# EasyEDA Pro project PCB_PressureSensitiveConverterBoard.epro

# Schematic Schematic1
Create Date: 2024-09-02; Page Name: P1; Project Name: FinalConverterBlock; Schematic Name: Schematic1; Update Date: 2024-09-02; Company: THU EE; Drawed: Sxz; Page Size: A4; Version: V1.0
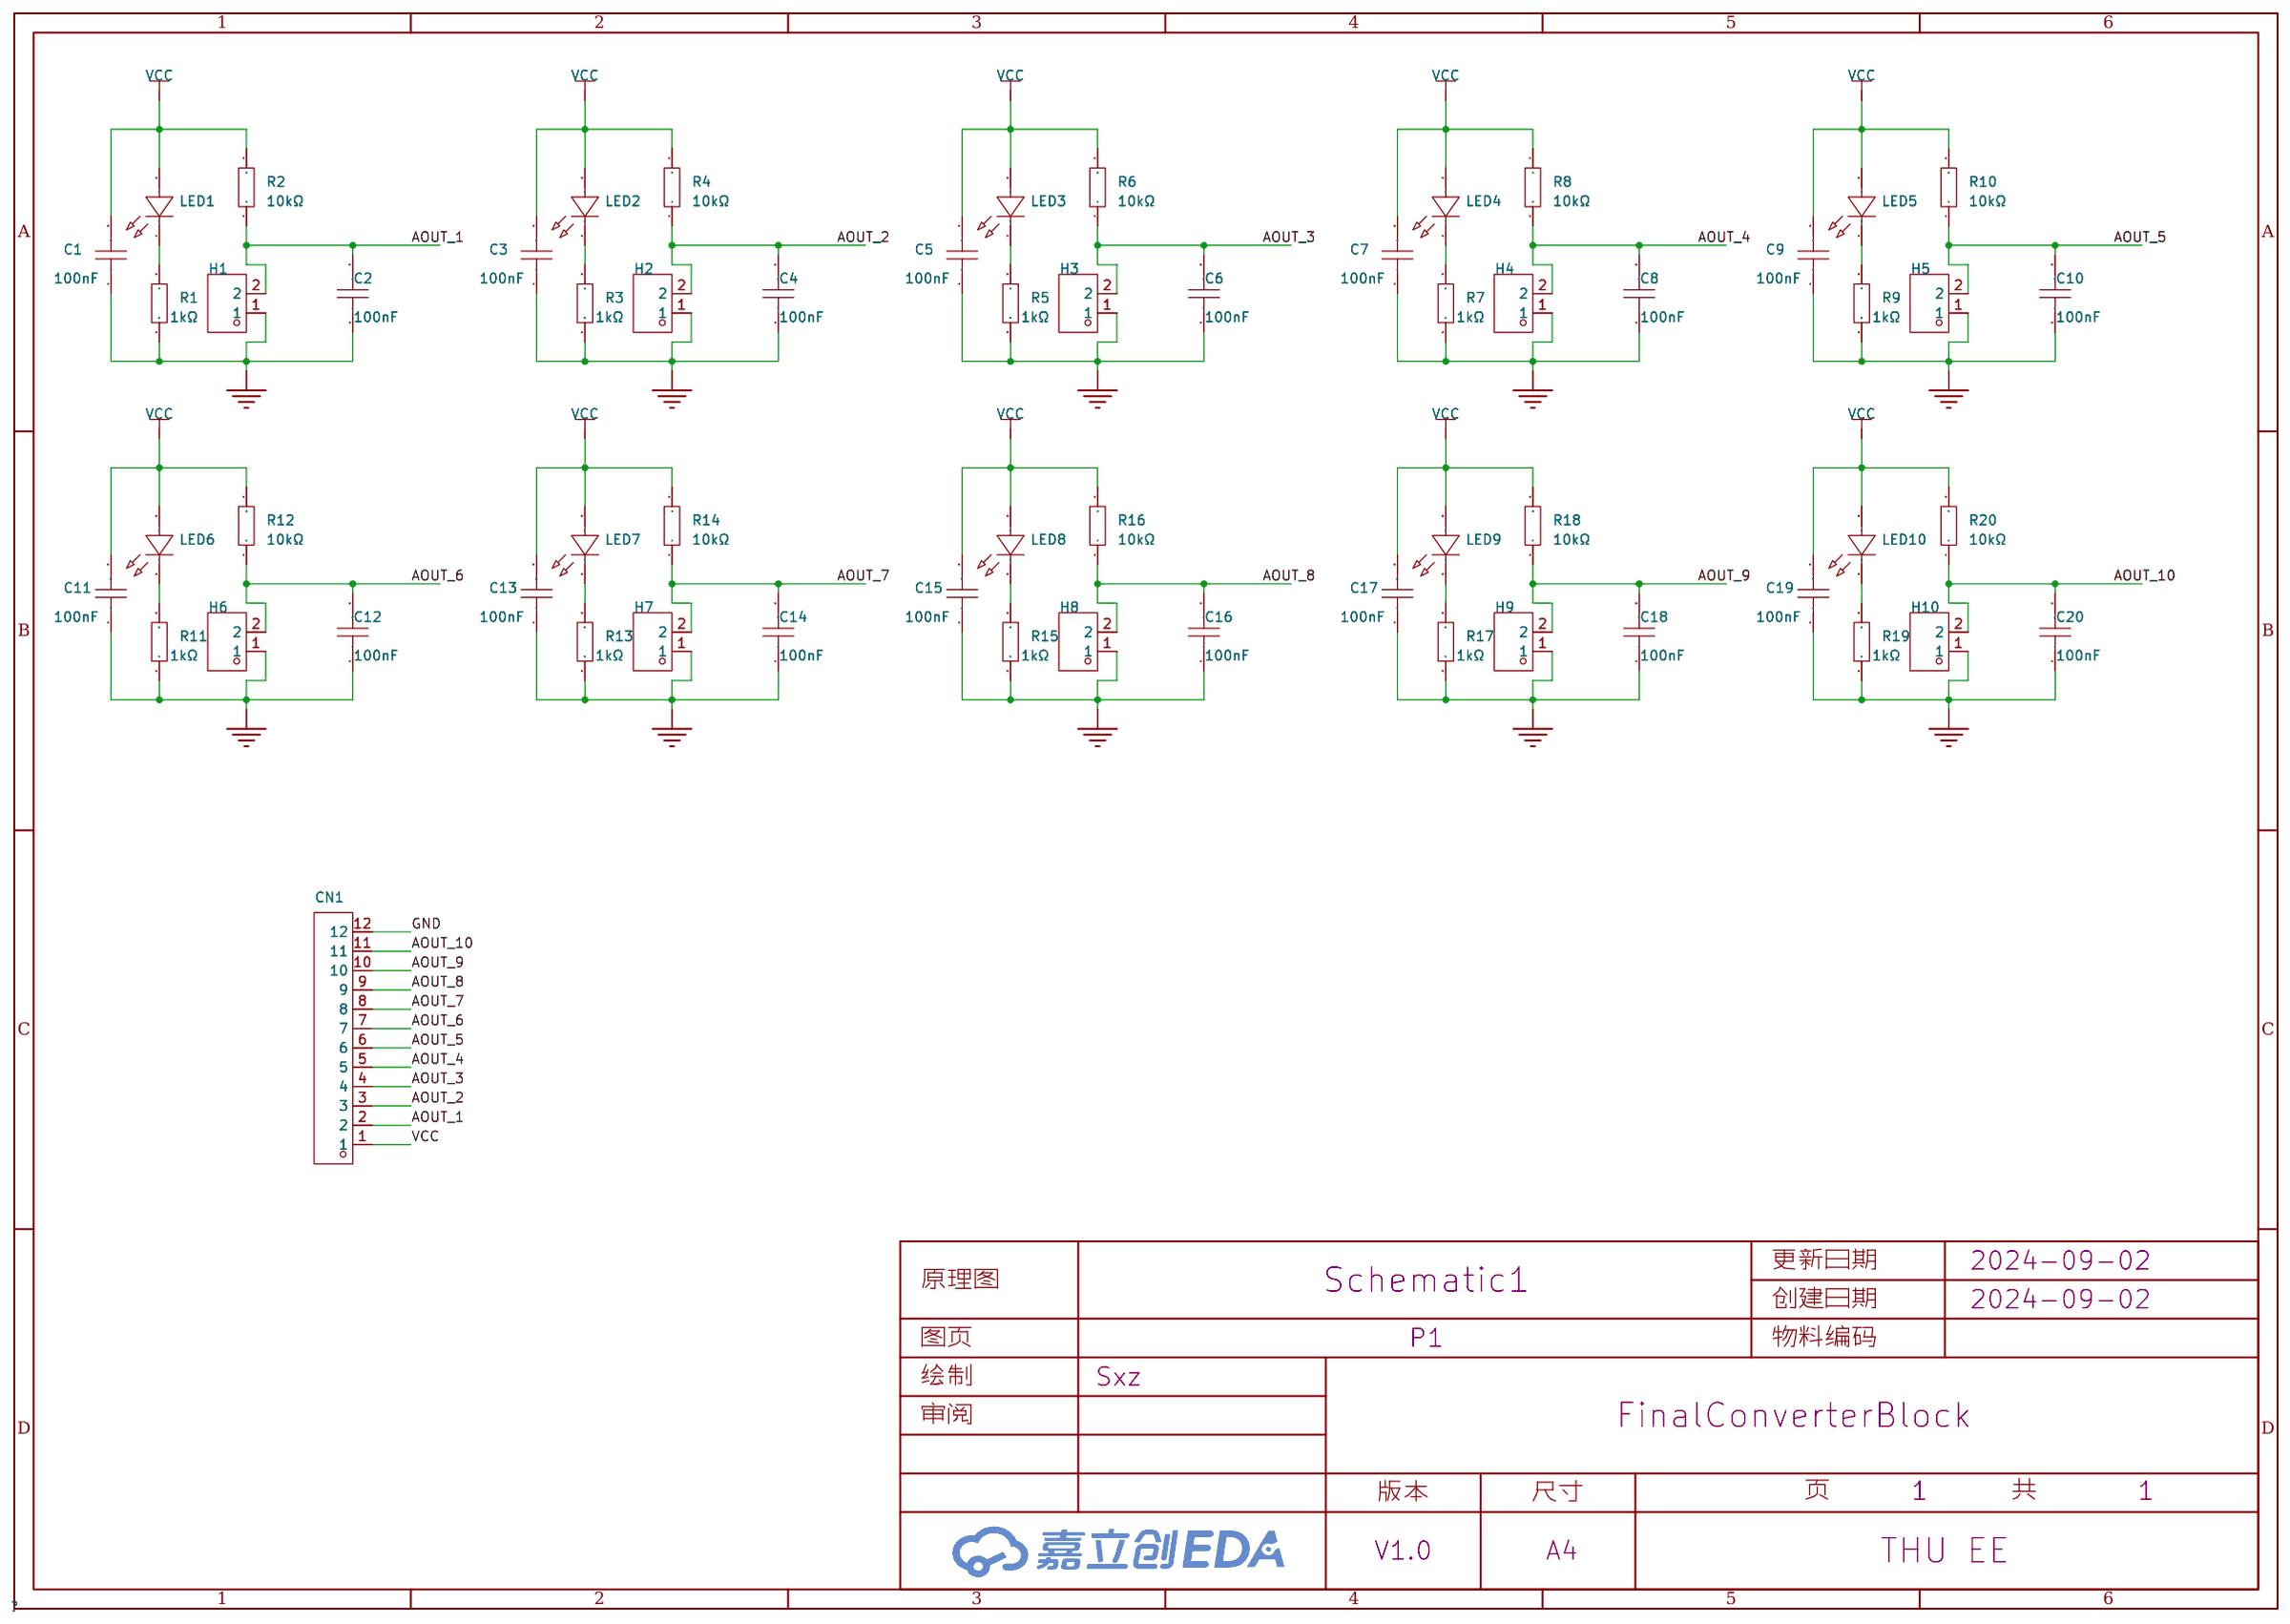
[diagram p0: schematic sheet]

## Parts
C1  100nF  [C0603]
C2  100nF  [C0603]
C3  100nF  [C0603]
C4  100nF  [C0603]
C5  100nF  [C0603]
C6  100nF  [C0603]
C7  100nF  [C0603]
C8  100nF  [C0603]
C9  100nF  [C0603]
C10  100nF  [C0603]
C11  100nF  [C0603]
C12  100nF  [C0603]
C13  100nF  [C0603]
C14  100nF  [C0603]
C15  100nF  [C0603]
C16  100nF  [C0603]
C17  100nF  [C0603]
C18  100nF  [C0603]
C19  100nF  [C0603]
C20  100nF  [C0603]
CN1  HB-PH3-254112PB2GOP  [HDR-TH_12P-P2.54-V-M]
H1  PZ254V-11-02P  [HDR-TH_2P-P2.54-V-M]
H2  PZ254V-11-02P  [HDR-TH_2P-P2.54-V-M]
H3  PZ254V-11-02P  [HDR-TH_2P-P2.54-V-M]
H4  PZ254V-11-02P  [HDR-TH_2P-P2.54-V-M]
H5  PZ254V-11-02P  [HDR-TH_2P-P2.54-V-M]
H6  PZ254V-11-02P  [HDR-TH_2P-P2.54-V-M]
H7  PZ254V-11-02P  [HDR-TH_2P-P2.54-V-M]
H8  PZ254V-11-02P  [HDR-TH_2P-P2.54-V-M]
H9  PZ254V-11-02P  [HDR-TH_2P-P2.54-V-M]
H10  PZ254V-11-02P  [HDR-TH_2P-P2.54-V-M]
LED1  XL-1608SURC-06  [LED0603-RD_RED]
LED2  XL-1608SURC-06  [LED0603-RD_RED]
LED3  XL-1608SURC-06  [LED0603-RD_RED]
LED4  XL-1608SURC-06  [LED0603-RD_RED]
LED5  XL-1608SURC-06  [LED0603-RD_RED]
LED6  XL-1608SURC-06  [LED0603-RD_RED]
LED7  XL-1608SURC-06  [LED0603-RD_RED]
LED8  XL-1608SURC-06  [LED0603-RD_RED]
LED9  XL-1608SURC-06  [LED0603-RD_RED]
LED10  XL-1608SURC-06  [LED0603-RD_RED]
R1  1kΩ  [R0603]
R2  10kΩ  [R0603]
R3  1kΩ  [R0603]
R4  10kΩ  [R0603]
R5  1kΩ  [R0603]
R6  10kΩ  [R0603]
R7  1kΩ  [R0603]
R8  10kΩ  [R0603]
R9  1kΩ  [R0603]
R10  10kΩ  [R0603]
R11  1kΩ  [R0603]
R12  10kΩ  [R0603]
R13  1kΩ  [R0603]
R14  10kΩ  [R0603]
R15  1kΩ  [R0603]
R16  10kΩ  [R0603]
R17  1kΩ  [R0603]
R18  10kΩ  [R0603]
R19  1kΩ  [R0603]
R20  10kΩ  [R0603]

## Library data of the parts
C1-C20 = CC0603KRX7R9BB104: 容值:100nF;精度:±10%;额定电压:50V;材质(温度系数):X7R;; LCSC Part Name: 100nF ±10% 50V; Supplier Part: C14663; Manufacturer: YAGEO(国巨); Supplier Footprint: 0603; Datasheet: https://atta.szlcsc.com/upload/public/pdf/source/20180910/C282072_33301C7F631E79921B82A8DAC6BCC5B3.pdf; Supplier: LCSC; Tolerance: ±10%; Voltage Rated: 50V; Temperature Coefficient: X7R
CN1 = HB-PH3-254112PB2GOP: 插针结构:1x12P;间距:2.54mm;行距:2.54mm;圆针/方针:方针;安装类型:直插;排数:单排;总PIN位数:12P;额定电流:3A;额定电压:250V;配合针长度:6mm;塑高:2.54mm;端接针长度:3mm;触头材质:黄铜;触头镀层:金;工作温度范围:-40℃~+105℃;焊接温度(最大值):260℃;颜色:黑色;; LCSC Part Name: 间距:2.54mm 1x12P 直插 方针; Supplier Part: C6332195; Manufacturer: HANBO(汉博); Supplier Footprint: 插件,P=2.54mm; Datasheet: https://atta.szlcsc.com/upload/public/pdf/source/20230803/F72D259687963761DF1B552F3BB84A31.pdf; Supplier: LCSC; Pin Structure: 1x12P; Pitch: 2.54mm; Row Spacing: 2.54mm; Circluar Pins/Square Pins: 方针; Mounting Type: 直插; Number of Rows: 单排; Number of Pins: 12P; Current Rating (Max): 3A; Voltage Rating (Max): 250V; Length of Mating Pin: 6mm; Insulation Height: 2.54mm; Length of End Connection Pin: 3mm; Contact Material: 黄铜; Contact Plating: 金; Operating Temperature Range: -40℃~+105℃; Soldering Temperature(Max): 260℃; Color: 黑色
H1-H10 = PZ254V-11-02P: 插针结构:1x2P;间距:2.54mm;行距:-;圆针/方针:方针;安装类型:直插;排数:单排;总PIN位数:2P;额定电流:-;额定电压:-;配合针长度:6mm;塑高:2.5mm;端接针长度:3mm;触头材质:黄铜;触头镀层:-;工作温度范围:-40℃~+105℃;颜色:黑色;; LCSC Part Name: 间距:2.54mm 1x2P 直插 方针; Supplier Part: C492401; Manufacturer: XFCN(兴飞); Supplier Footprint: 插件,P=2.54mm; Datasheet: https://atta.szlcsc.com/upload/public/pdf/source/20200309/C492401_A812433581A9B211A7FFA413ADDFF0E5.pdf; Supplier: LCSC; Pin Structure: 1x2P; Pitch: 2.54mm; Circluar Pins/Square Pins: 方针; Mounting Type: 直插; Number of Rows: 单排; Number of Pins: 2P; Length of Mating Pin: 6mm; Insulation Height: 2.5mm; Length of End Connection Pin: 3mm; Contact Material: 黄铜; Operating Temperature Range: -40℃~+105℃; Color: 黑色
LED1-LED10 = XL-1608SURC-06: 发光颜色:红色;功率:55mW;正向电流:25mA;主波长:617nm~621nm;透镜颜色:无色透明透镜;色温:-;发光角度:120°;载带方式:正贴;工作温度:-30℃~+85℃;; Supplier Part: C965799; Manufacturer: XINGLIGHT(成兴光); Supplier Footprint: 0603; Datasheet: https://atta.szlcsc.com/upload/public/pdf/source/20221102/D860AFDD1CDB02C5A8064103A32707E2.pdf; Supplier: LCSC; Emitted Color: 红色; Power Dissipation: 55mW; Forward Current: 25mA; Dominant Wavelength: 617nm~621nm; Peak Wavelength: 623nm; Lens Color: 无色透明透镜; Viewing Angle: 120°; Mounting Sytle: 正贴; Operating Temperature: -30℃~+85℃
R1 R3 R5 R7 R9 R11 R13 R15 R17 R19 = 0603WAF1001T5E: 电阻类型:厚膜电阻;阻值:1kΩ;精度:±1%;功率:100mW;最大工作电压:75V;温度系数:±100ppm/℃;; LCSC Part Name: 1kΩ ±1% 100mW 厚膜电阻; Supplier Part: C21190; Manufacturer: UNI-ROYAL(厚声); Supplier Footprint: 0603; Datasheet: https://atta.szlcsc.com/upload/public/pdf/source/20200306/C422600_1E6D84923E4A46A82E41ADD87F860B5C.pdf; Supplier: LCSC; Type: 厚膜电阻; Tolerance: ±1%; Power(Watts): 100mW; Overload Voltage (Max): 75V; Temperature Coefficient: ±100ppm/℃; Operating Temperature Range: -55℃~+155℃
R2 R4 R6 R8 R10 R12 R14 R16 R18 R20 = 0603WAF1002T5E: 电阻类型:厚膜电阻;阻值:10kΩ;精度:±1%;功率:100mW;最大工作电压:75V;温度系数:±100ppm/℃;; LCSC Part Name: 厚膜电阻 10kΩ ±1% 100mW; Supplier Part: C25804; Manufacturer: UNI-ROYAL(厚声); Supplier Footprint: 0603; Datasheet: https://atta.szlcsc.com/upload/public/pdf/source/20200306/C422600_1E6D84923E4A46A82E41ADD87F860B5C.pdf; Supplier: LCSC; Type: 厚膜电阻; Tolerance: ±1%; Power(Watts): 100mW; Overload Voltage (Max): 75V; Temperature Coefficient: ±100ppm/℃; Operating Temperature Range: -55℃~+155℃

## Nets
GND: C1.1 C2.1 C3.1 C4.1 C5.1 C6.1 C7.1 C8.1 C9.1 C10.1 C11.1 C12.1 C13.1 C14.1 C15.1 C16.1 C17.1 C18.1 C19.1 C20.1 CN1.12 H1.1 H2.1 H3.1 H4.1 H5.1 H6.1 H7.1 H8.1 H9.1 H10.1 R1.1 R3.1 R5.1 R7.1 R9.1 R11.1 R13.1 R15.1 R17.1 R19.1
VCC: C1.2 C3.2 C5.2 C7.2 C9.2 C11.2 C13.2 C15.2 C17.2 C19.2 CN1.1 LED1.2(A) LED2.2(A) LED3.2(A) LED4.2(A) LED5.2(A) LED6.2(A) LED7.2(A) LED8.2(A) LED9.2(A) LED10.2(A) R2.2 R4.2 R6.2 R8.2 R10.2 R12.2 R14.2 R16.2 R18.2 R20.2
AOUT_1: C2.2 CN1.2 H1.2 R2.1
AOUT_2: C4.2 CN1.3 H2.2 R4.1
AOUT_3: C6.2 CN1.4 H3.2 R6.1
AOUT_4: C8.2 CN1.5 H4.2 R8.1
AOUT_5: C10.2 CN1.6 H5.2 R10.1
AOUT_6: C12.2 CN1.7 H6.2 R12.1
AOUT_7: C14.2 CN1.8 H7.2 R14.1
AOUT_8: C16.2 CN1.9 H8.2 R16.1
AOUT_9: C18.2 CN1.10 H9.2 R18.1
AOUT_10: C20.2 CN1.11 H10.2 R20.1
$1N325: LED1.1(K) R1.2
$1N5135: LED2.1(K) R3.2
$1N5415: LED3.1(K) R5.2
$1N5695: LED4.1(K) R7.2
$1N5975: LED5.1(K) R9.2
$1N6255: LED6.1(K) R11.2
$1N6535: LED7.1(K) R13.2
$1N7095: LED8.1(K) R15.2
$1N7375: LED9.1(K) R17.2
$1N7655: LED10.1(K) R19.2

# Board PCB1
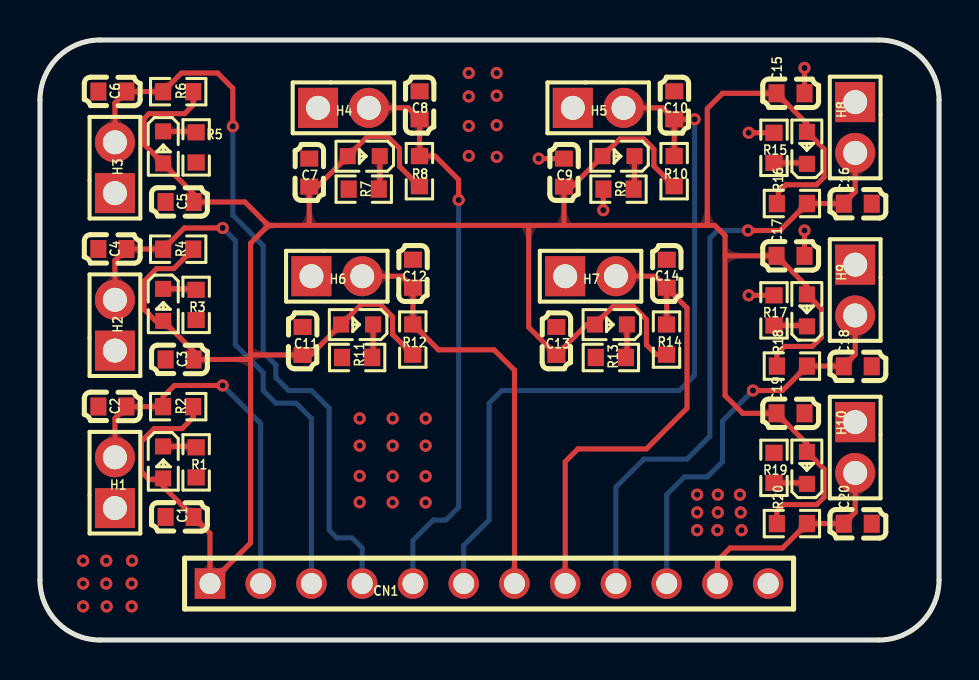
[diagram p1: board, top side]
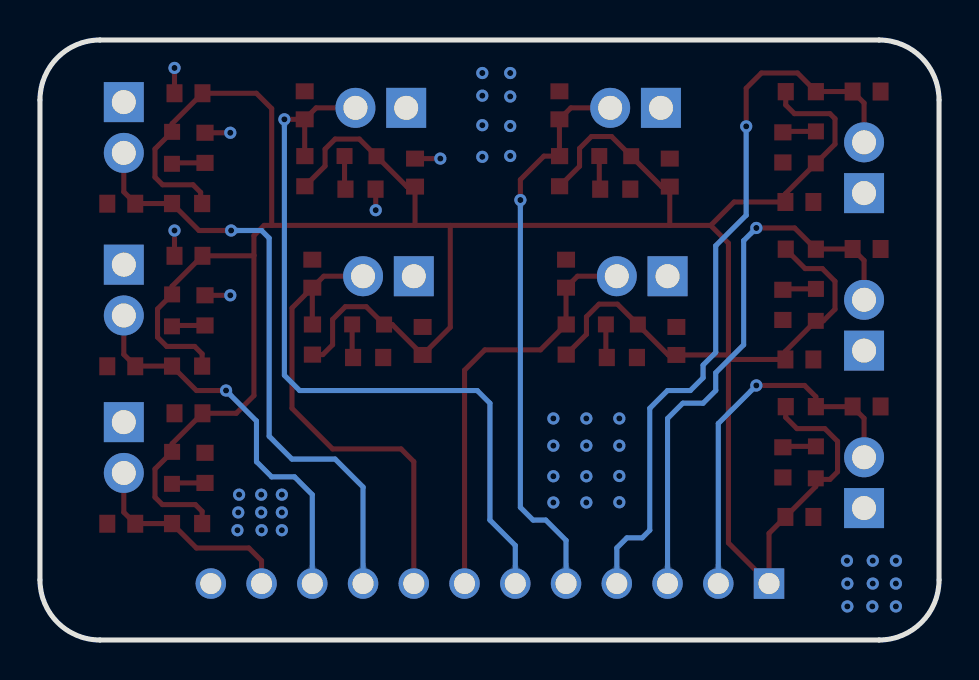
[diagram p2: board, bottom side, seen from below]

Outline 45 x 30 mm; copper layers: Top Layer, Bottom Layer. Coordinates in mm from the lower left corner of the outline.
Outline path: 0,27 0,3 arc(0.88,0.88) 3,0 42,0 arc(44.12,0.88) 45,3 45,27 arc(44.12,29.12) 42,30 3,30 arc(0.88,29.12) 0,27
Stack: Top Layer 0.035mm / Dielectric1 1.51mm FR4 er 4.5 / Bottom Layer 0.035mm

## Design rules (mm)
template: 自定义配置
spacing copperThickness1oz (default): track to track 0.102, other pairs 0.152 to 0.3
spacing copperThickness2oz: track to track 0.203, other pairs 0.152 to 0.3
track width copperThickness1oz (default): min 0.127, default 0.254, max 2.54
track width copperThickness2oz: min 0.203, default 0.254, max 2.54
differential pair differentialPair (default): width min 0.127, default 0.254, max 2.54; gap min 0.152, default 0.152
via viaSize (default): diameter min 0.5, default 0.61, max 10; hole min 0.3, default 0.305, max 6.3

## Placement (name value [footprint] x y rotation side)
C1  100nF  [C0603]  6.99 6.15 0 top
C2  100nF  [C0603]  3.63 11.68 0 top
C3  100nF  [C0603]  6.99 14.03 0 top
C4  100nF  [C0603]  3.63 19.55 0 top
C5  100nF  [C0603]  6.99 21.9 0 top
C6  100nF  [C0603]  3.63 27.42 0 top
C7  100nF  [C0603]  13.48 23.37 270 top
C8  100nF  [C0603]  19 26.73 270 top
C9  100nF  [C0603]  26.23 23.37 270 top
C10  100nF  [C0603]  31.75 26.73 270 top
C11  100nF  [C0603]  13.15 14.95 270 top
C12  100nF  [C0603]  18.67 18.32 270 top
C13  100nF  [C0603]  25.85 14.95 270 top
C14  100nF  [C0603]  31.37 18.32 270 top
C15  100nF  [C0603]  37.57 27.34 180 top
C16  100nF  [C0603]  40.93 21.81 180 top
C17  100nF  [C0603]  37.57 19.21 180 top
C18  100nF  [C0603]  40.93 13.69 180 top
C19  100nF  [C0603]  37.57 11.34 180 top
C20  100nF  [C0603]  40.93 5.81 180 top
CN1  HB-PH3-254112PB2GOP  [HDR-TH_12P-P2.54-V-M]  22.48 2.82 0 top
H1  PZ254V-11-02P  [HDR-TH_2P-P2.54-V-M]  3.75 7.87 90 top
H2  PZ254V-11-02P  [HDR-TH_2P-P2.54-V-M]  3.75 15.74 90 top
H3  PZ254V-11-02P  [HDR-TH_2P-P2.54-V-M]  3.75 23.61 90 top
H4  PZ254V-11-02P  [HDR-TH_2P-P2.54-V-M]  15.19 26.61 0 top
H5  PZ254V-11-02P  [HDR-TH_2P-P2.54-V-M]  27.94 26.61 0 top
H6  PZ254V-11-02P  [HDR-TH_2P-P2.54-V-M]  14.86 18.19 0 top
H7  PZ254V-11-02P  [HDR-TH_2P-P2.54-V-M]  27.56 18.19 0 top
H8  PZ254V-11-02P  [HDR-TH_2P-P2.54-V-M]  40.8 25.62 270 top
H9  PZ254V-11-02P  [HDR-TH_2P-P2.54-V-M]  40.8 17.5 270 top
H10  PZ254V-11-02P  [HDR-TH_2P-P2.54-V-M]  40.8 9.62 270 top
LED1  XL-1608SURC-06  [LED0603-RD_RED]  6.17 8.88 270 top
LED2  XL-1608SURC-06  [LED0603-RD_RED]  6.17 16.76 270 top
LED3  XL-1608SURC-06  [LED0603-RD_RED]  6.17 24.63 270 top
LED4  XL-1608SURC-06  [LED0603-RD_RED]  16.21 24.19 180 top
LED5  XL-1608SURC-06  [LED0603-RD_RED]  28.96 24.19 180 top
LED6  XL-1608SURC-06  [LED0603-RD_RED]  15.87 15.78 180 top
LED7  XL-1608SURC-06  [LED0603-RD_RED]  28.58 15.78 180 top
LED8  XL-1608SURC-06  [LED0603-RD_RED]  38.39 24.61 90 top
LED9  XL-1608SURC-06  [LED0603-RD_RED]  38.39 16.48 90 top
LED10  XL-1608SURC-06  [LED0603-RD_RED]  38.39 8.61 90 top
R1  1kΩ  [R0603]  7.82 8.88 90 top
R2  10kΩ  [R0603]  6.92 11.67 0 top
R3  1kΩ  [R0603]  7.82 16.76 90 top
R4  10kΩ  [R0603]  6.92 19.54 0 top
R5  1kΩ  [R0603]  7.82 24.63 90 top
R6  10kΩ  [R0603]  6.92 27.42 0 top
R7  1kΩ  [R0603]  16.21 22.54 0 top
R8  10kΩ  [R0603]  18.99 23.44 270 top
R9  1kΩ  [R0603]  28.96 22.54 0 top
R10  10kΩ  [R0603]  31.74 23.44 270 top
R11  1kΩ  [R0603]  15.87 14.12 0 top
R12  10kΩ  [R0603]  18.66 15.02 270 top
R13  1kΩ  [R0603]  28.58 14.12 0 top
R14  10kΩ  [R0603]  31.36 15.02 270 top
R15  1kΩ  [R0603]  36.74 24.61 270 top
R16  10kΩ  [R0603]  37.64 21.82 180 top
R17  1kΩ  [R0603]  36.74 16.48 270 top
R18  10kΩ  [R0603]  37.64 13.7 180 top
R19  1kΩ  [R0603]  36.74 8.61 270 top
R20  10kΩ  [R0603]  37.64 5.82 180 top

## Footprints (pads in the part's own frame, mm; a bottom-side part is the same pattern mirrored in y, then rotated)
C0603
  rect 0.8x0.9 smd: 1(-0.7,0) 2(0.7,0)
HDR-TH_2P-P2.54-V-M
  rect 2x2 hole 1.2: 1(-1.27,0)
  round 2 hole 1.2: 2(1.27,0)
HDR-TH_12P-P2.54-V-M
  rect 1.524x1.524 hole 1.05: 1(-13.97,0)
  round 1.524 hole 1.05: 2(-11.43,0) 3(-8.89,0) 4(-6.35,0) 5(-3.81,0) 6(-1.27,0) 7(1.27,0) 8(3.81,0) 9(6.35,0) 10(8.89,0) 11(11.43,0) 12(13.97,0)
LED0603-RD_RED
  rect 0.8x0.8 smd: 1(-0.799,-0.004) 2(0.799,0.004)
R0603
  rect 0.806x0.864 smd: 1(-0.753,0) 2(0.753,0)

## Nets
As in the schematic.

## Via types
v1: diameter 0.61, hole 0.305, Top Layer to Bottom Layer, 51 vias

## Routing (per net, layer and track width the routed paths; a pad name or vN(x,y) marks a point on that pad's centre or on a via; arc(x,y) is an arc through that point)
GND: length 7.4
  Top Layer w0.254: 36.74,25.36 v1(35.47,25.36) ; 38.27,27.34 v1(38.27,28.6) ; C9.1 v1(24.96,24.07) ; 28.24,22.54 28.19,22.49 v1(28.19,21.49) ; 36.74,17.23 v1(35.47,17.23) ; 38.27,19.21 v1(38.27,20.47)
  vias: v1(2.16,3.96) v1(2.16,2.82) v1(2.16,1.68) v1(3.32,3.96) v1(3.32,2.82) v1(3.34,1.68) v1(4.61,3.96) v1(4.59,2.82) v1(4.59,1.68) v1(16,11.08) v1(16,9.72) v1(16,8.2) v1(16,6.89) v1(17.65,11.08) v1(17.65,9.72) v1(17.65,8.19) v1(17.65,6.87) v1(19.3,11.08) v1(19.3,9.72) v1(19.3,8.19) v1(19.3,6.87) v1(21.46,28.35) v1(21.46,27.18) v1(21.46,25.7) v1(21.46,24.2) v1(22.86,28.35) v1(22.86,27.22) v1(22.86,25.74) v1(22.86,24.16) v1(32.89,7.27) v1(32.89,6.38) v1(32.89,5.49) v1(33.91,5.49) v1(33.93,7.27) v1(33.93,6.38) v1(35.03,7.27) v1(35.07,6.38) v1(35.12,5.49)
VCC: length 173
  Top Layer w0.254: 34.29,19.23 34.31,19.21 C17.2 38.39,17.69 LED9.2 39.12,16.55 39.12,15.14 38.65,14.68 37.26,14.68 36.88,14.31 R18.2 ; 34.29,19.23 34.29,20.22 33.78,20.73 33.4,20.73 ; 34.29,19.23 34.29,12.22 35.17,11.34 C19.2 38.39,9.81 LED10.2 39.24,8.55 39.24,7.14 38.87,6.77 37.22,6.77 36.88,6.43 R20.2 ; R10.2 30.73,23.7 30.73,24.54 30.23,25.05 29.01,25.05 LED5.2 26.64,22.67 C9.2 26.23,20.73 ; 13.48,20.73 13.48,20.73 C7.2 13.89,22.67 LED4.2 16.39,25.17 17.4,25.17 17.99,24.58 17.99,23.69 R8.2 ; 13.48,20.73 11.43,20.73 ; 13.48,20.73 24.46,20.73 ; 33.4,20.73 33.4,26.57 34.17,27.34 C15.2 38.39,25.82 LED8.2 39.24,24.55 39.24,23.14 38.86,22.76 37.34,22.76 36.96,22.38 36.96,21.9 R16.2 ; 33.4,20.73 24.46,20.73 ; R2.2 7.67,11.13 7.11,10.57 5.71,10.57 5.08,9.93 5.08,8.41 5.46,8.03 6.12,8.03 LED1.2 6.17,7.67 7.69,6.15 8.51,5.33 CN1.1 10.54,4.85 10.54,14 ; R12.2 17.65,15.28 17.65,16.16 17.02,16.79 16.09,16.79 LED6.2 13.55,14.25 C11.2 10.61,14.25 10.54,14.32 ; 11.43,20.73 10.54,19.84 10.54,14.32 ; 11.43,20.73 10.26,21.9 7.69,21.9 7.69,22.31 LED3.2 5.21,24.79 5.21,26.06 5.46,26.32 7.24,26.32 7.67,26.75 R6.2 ; 10.54,14.32 10.54,14 ; 24.46,20.73 24.46,15.63 C13.2 27.37,15.77 LED7.2 28.67,16.66 29.72,16.66 30.35,16.03 30.35,14.76 30.84,14.27 R14.2 ; 10.54,14 10.52,14.03 7.69,14.03 7.69,14.44 LED2.2 5.79,15.96 5.21,16.54 5.21,17.94 5.84,18.57 6.7,18.57 R4.2
AOUT_1: length 19
  Top Layer w0.254: 4.33,11.67 4.33,11.68 ; 4.33,11.67 3.75,11.09 H1.2 ; 4.33,11.67 6.17,11.67 6.17,12.16 6.73,12.73 v1(9.14,12.73)
  Bottom Layer w0.254: CN1.2 11.05,10.82 v1(9.14,12.73)
AOUT_2: length 28.3
  Top Layer w0.254: v1(9.14,20.6) 7.23,20.6 6.17,19.54 6.16,19.55 4.33,19.55 3.75,18.98 H2.2
  Bottom Layer w0.254: CN1.3 13.59,11.08 12.83,11.84 11.81,11.84 11.18,12.47 11.18,13.36 9.78,14.76 9.78,19.97 v1(9.14,20.6)
AOUT_3: length 37.4
  Top Layer w0.254: v1(9.65,25.68) 9.65,27.59 8.89,28.35 7.08,28.35 6.16,27.42 ; 6.16,27.42 4.33,27.42 3.75,26.85 3.75,24.88 ; 6.16,27.42 6.17,27.42
  Bottom Layer w0.254: CN1.4 16.13,4.6 15.62,5.11 14.86,5.11 14.48,5.49 14.48,11.58 13.59,12.47 12.45,12.47 11.81,13.11 11.81,13.74 11.18,14.38 11.18,19.71 9.65,21.24 v1(9.65,25.68)
AOUT_4: length 28.6
  Top Layer w0.254: v1(20.95,22) 20.95,23.02 19.78,24.19 R8.1 19,24.2 C8.2 18.43,26.61 H4.2
  Bottom Layer w0.254: v1(20.95,22) 20.95,6.63 20.32,6 19.68,6 18.67,4.98 CN1.5
AOUT_5: length 38.8
  Top Layer w0.254: C10.2 v1(32.77,26.03) ; C10.2 31.75,24.2 R10.1 ; C10.2 31.18,26.61 H5.2
  Bottom Layer w0.254: CN1.6 21.21,4.73 22.48,6 22.48,11.84 23.11,12.47 32,12.47 32.77,13.24 v1(32.77,26.03)
AOUT_6: length 21.3
  Top Layer w0.254: H6.2 18.1,18.19 C12.2 18.67,15.78 ; 18.67,15.78 19.95,14.51 22.73,14.51 23.75,13.49 CN1.7 ; 18.67,15.78 R12.1
AOUT_7: length 24.4
  Top Layer w0.254: C14.2 31.37,15.78 R14.1 ; C14.2 32.39,16.6 32.39,11.58 30.35,9.55 26.92,9.55 26.29,8.92 CN1.8 ; C14.2 30.8,18.19 H7.2
AOUT_8: length 30.7
  Top Layer w0.254: 40.22,21.82 R16.1 37.04,20.47 v1(35.43,20.47) ; 40.22,21.82 40.8,22.41 H8.2 ; 40.22,21.82 C16.2
  Bottom Layer w0.254: v1(35.43,20.47) 33.91,20.47 33.53,20.09 33.53,10.19 32.39,9.05 30.23,9.05 28.83,7.65 CN1.9
AOUT_9: length 19.9
  Top Layer w0.254: 40.22,13.7 C18.2 ; 40.22,13.7 R18.1 37.17,12.47 v1(35.69,12.47) ; 40.22,13.7 40.8,14.28 H9.2
  Bottom Layer w0.254: v1(35.69,12.47) 34.16,10.95 34.16,8.92 33.4,8.16 32.26,8.16 31.37,7.27 CN1.10
AOUT_10: length 11
  Top Layer w0.254: CN1.11 33.91,3.96 34.54,4.6 37.17,4.6 R20.1 40.22,5.82 C20.2 40.8,6.39 H10.2
$1N325: length 1.7
  Top Layer w0.254: LED1.1 7.77,9.68 R1.2
$1N5135: length 1.7
  Top Layer w0.254: R3.2 7.77,17.56 LED2.1
$1N5415: length 1.7
  Top Layer w0.254: LED3.1 7.77,25.43 R5.2
$1N5695: length 1.7
  Top Layer w0.254: R7.2 17.01,22.59 LED4.1
$1N5975: length 1.7
  Top Layer w0.254: R9.2 29.76,22.59 LED5.1
$1N6255: length 1.7
  Top Layer w0.254: R11.2 16.67,14.17 LED6.1
$1N6535: length 1.7
  Top Layer w0.254: R13.2 29.37,14.17 LED7.1
$1N7095: length 1.7
  Top Layer w0.254: LED8.1 38.35,23.86 R15.2
$1N7375: length 1.7
  Top Layer w0.254: LED9.1 38.35,15.73 R17.2
$1N7655: length 1.7
  Top Layer w0.254: LED10.1 38.35,7.85 R19.2

## Copper pours and planes (outline as drawn; the poured copper is in the pictures)
GND on Top Layer: -1.02,33.94 51.43,33.94 51.43,-1.5 -1.02,-1.5
GND on Bottom Layer: -2.92,34.57 56.39,34.57 56.39,-3.27 -2.92,-3.27

Small or netless copper shapes (teardrops, artwork), in the pictures only: 122 on Top Layer, 14 on Bottom Layer
